# Altium schematic sheet 2020年电赛校赛测量、基准板.SchDoc
size A4; DocumentNumber: 3; Revision: V2.0; SheetNumber: 3; SheetTotal: 5
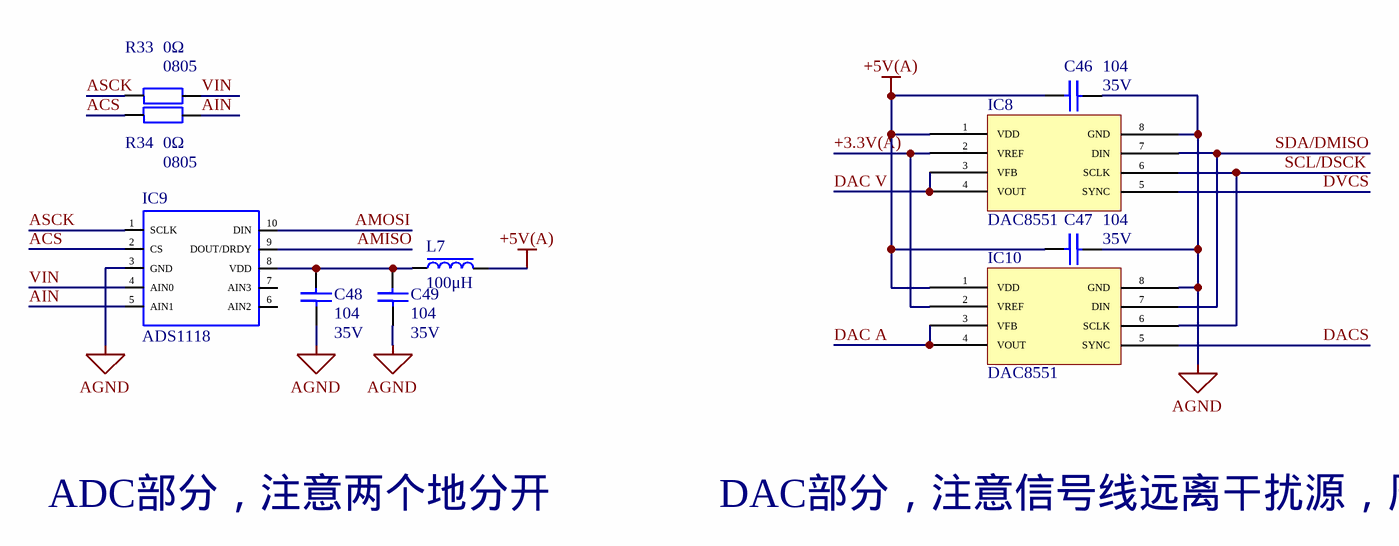
[diagram p0: 2020年电赛校赛测量、基准板.SchDoc]

## Parts
C46  104  value 35V  [C0805]
C47  104  value 35V  [C0805]
C48  104  value 35V  [C0805]
C49  104  value 35V  [C0805]
IC8  DAC8551  [MSOP-8]
IC9  ADS1118  [MSOP-10]
IC10  DAC8551  [MSOP-8]
L7  100μH  [R0805]
R33  0Ω  value 0805  [R0805]
R34  0Ω  value 0805  [R0805]

## Nets
+5V(A): C46.1 C47.1 IC8.1(VDD) IC10.1(VDD) L7.1
AGND: C46.2 C47.2 C48.1 C49.1 IC8.8(GND) IC9.3(GND) IC10.8(GND)
+3.3V(A): IC8.2(VREF) IC10.2(VREF)
ACS: IC9.2(CS) R34.1
AIN: IC9.5(AIN1) R34.2
AMISO: IC9.9(DOUT/DRDY)
AMOSI: IC9.10(DIN)
ASCK: IC9.1(SCLK) R33.1
DAC A: IC10.3(VFB) IC10.4(VOUT)
DAC V: IC8.3(VFB) IC8.4(VOUT)
DACS: IC10.5(SYNC)
DVCS: IC8.5(SYNC)
SCL/DSCK: IC8.6(SCLK) IC10.6(SCLK)
SDA/DMISO: IC8.7(DIN) IC10.7(DIN)
VIN: IC9.4(AIN0) R33.2
NetC48_2: C48.2 C49.2 IC9.8(VDD) L7.2

Not connected (* = marked no-connect by the designer): IC9 6(AIN2) 7(AIN3)

## Notes on the sheet
- ADC部分，注意两个地分开
- DAC部分，注意信号线远离干扰源，周围围模拟地

## Library data of the parts
C46-C49 = 104: 无极性电容
IC9 = ADS1118: 16bit ADC 860SPS 4路单端/两路差分
L7 = 470mH: 电感
R33 R34 = 10kΩ: 贴片/直插电阻